# EAGLE design mainboard (EAGLE 9.6.2)
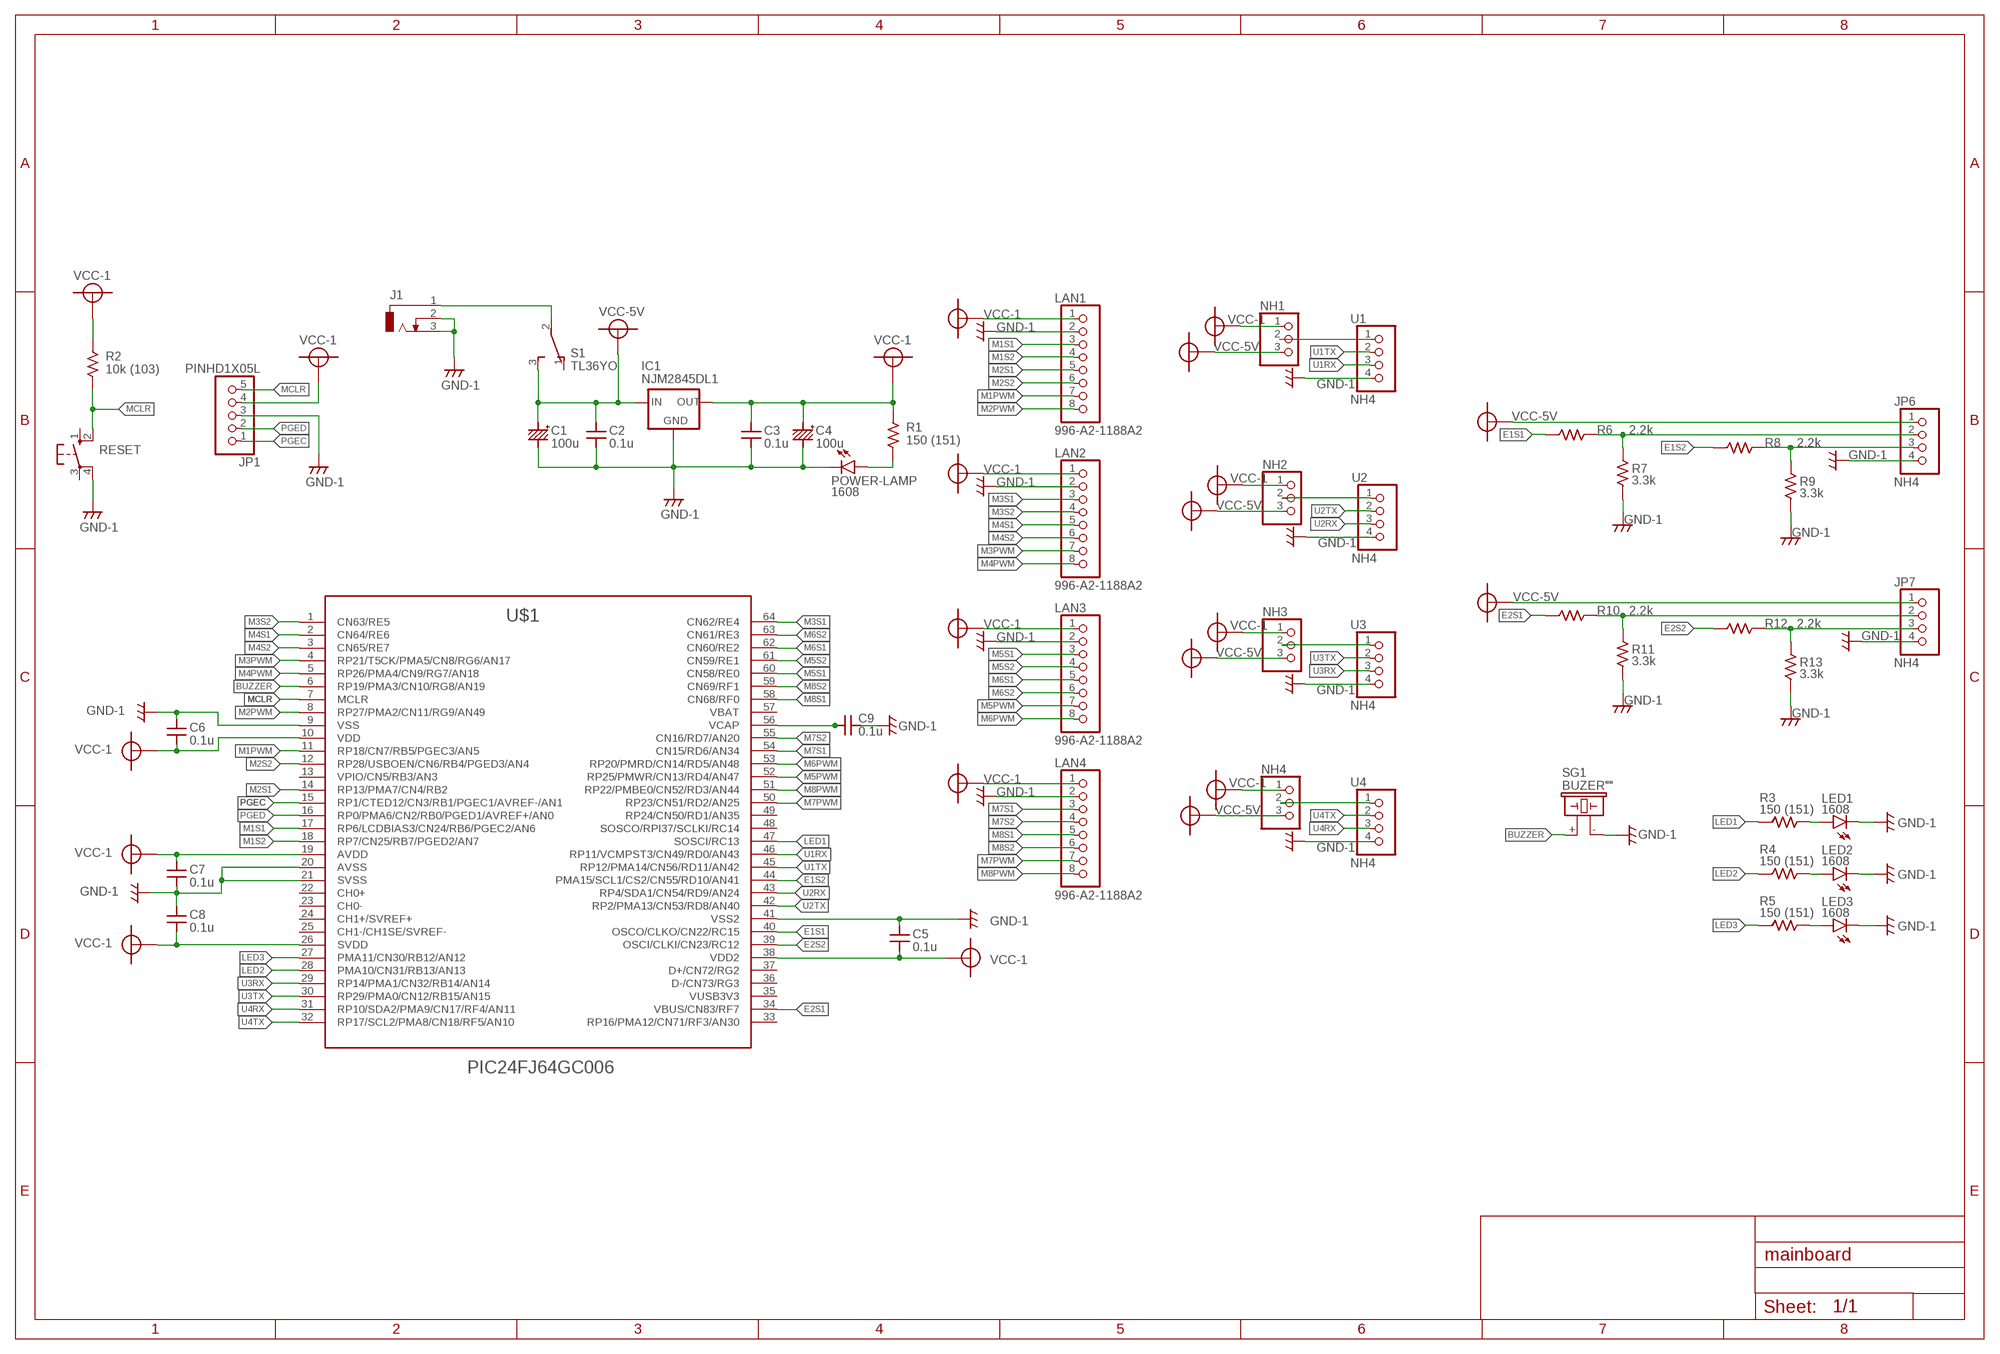
[diagram p0: schematic, sheet 1]

## Parts
C1  100u  C+25V100  [CC:3]
C2  0.1u  CC1068  [C1608]
C3  0.1u  CC1068  [C1608]
C4  100u  C+25V100  [CC:3]
C5  0.1u  CC1068  [C1608]
C6  0.1u  CC1068  [C1608]
C7  0.1u  CC1068  [C1608]
C8  0.1u  CC1068  [C1608]
C9  0.1u  CC1068  [C1608]
IC1  NJM2845DL1  [TO252]
J1  DCJ0303  [DCJ0303]
JP1  PINHD1X05L  [1X05L]
JP6  NH4  [NH4]
JP7  NH4  [NH4]
LAN1  996-A2-1188A2  [996-A2-1188A2]
LAN2  996-A2-1188A2  [996-A2-1188A2]
LAN3  996-A2-1188A2  [996-A2-1188A2]
LAN4  996-A2-1188A2  [996-A2-1188A2]
LED1  1608  LEDCHIP-LED0603  [CHIP-LED0603]
LED2  1608  LEDCHIP-LED0603  [CHIP-LED0603]
LED3  1608  LEDCHIP-LED0603  [CHIP-LED0603]
NH1  PINHD-1X3  [1X03]
NH2  PINHD-1X3  [1X03]
NH3  PINHD-1X3  [1X03]
NH4  PINHD-1X3  [1X03]
POWER-LAMP  1608  LEDCHIP-LED0603  [CHIP-LED0603]
R1  150 (151)  R1/10W  [C1608]
R2  10k (103)  R1/10W  [C1608]
R3  150 (151)  R1/10W  [C1608]
R4  150 (151)  R1/10W  [C1608]
R5  150 (151)  R1/10W  [C1608]
R6  2.2k  R1/10W  [C1608]
R7  3.3k  R1/10W  [C1608]
R8  2.2k  R1/10W  [C1608]
R9  3.3k  R1/10W  [C1608]
R10  2.2k  R1/10W  [C1608]
R11  3.3k  R1/10W  [C1608]
R12  2.2k  R1/10W  [C1608]
R13  3.3k  R1/10W  [C1608]
RESET  10-XX  [B3F-10XX]
S1  TL36YO  [TL3XYO]
SG1  BUZER""  [F/CM12P]
U1  NH4  [NH4]
U2  NH4  [NH4]
U3  NH4  [NH4]
U4  NH4  [NH4]
U$1  PIC24FJ64GC006  [TQFP64-10X10]

## Nets
+5V: C1.+(P$1+) C2.1 IC1.1(IN) JP6.1 JP7.1 NH1.3 NH2.3 NH3.3 NH4.3 S1.3(S) ; supply symbol labelled VCC-5V
BUZZER: SG1.+ U$1.6(RP19/PMA3/CN10/RG8/AN19)
E1S1: R6.2 U$1.40(OSCO/CLKO/CN22/RC15)
E1S2: R8.2 U$1.44(PMA15/SCL1/CS2/CN55/RD10/AN41)
E2S1: R10.2 U$1.34(VBUS/CN83/RF7)
E2S2: R12.2 U$1.39(OSCI/CLKI/CN23/RC12)
GND: C1.-(P$2-) C2.2 C3.2 C4.-(P$2-) C5.1 C6.1 C7.2 C8.1 C9.2 IC1.2(GND) J1.2 J1.3 JP1.3 JP6.4 JP7.4 LAN1.2 LAN2.2 LAN3.2 LAN4.2 LED1.C LED2.C LED3.C POWER-LAMP.C R7.2 R9.2 R11.2 R13.2 RESET.4(P1) SG1.- U1.4 U2.4 U3.4 U4.4 U$1.9(VSS) U$1.20(AVSS) U$1.21(SVSS) U$1.41(VSS2) ; supply symbol labelled GND-1
LED1: R3.2 U$1.47(SOSCI/RC13)
LED2: R4.2 U$1.28(PMA10/CN31/RB13/AN13)
LED3: R5.2 U$1.27(PMA11/CN30/RB12/AN12)
M1PWM: LAN1.7 U$1.11(RP18/CN7/RB5/PGEC3/AN5)
M1S1: LAN1.3 U$1.17(RP6/LCDBIAS3/CN24/RB6/PGEC2/AN6)
M1S2: LAN1.4 U$1.18(RP7/CN25/RB7/PGED2/AN7)
M2PWM: LAN1.8 U$1.8(RP27/PMA2/CN11/RG9/AN49)
M2S1: LAN1.5 U$1.14(RP13/PMA7/CN4/RB2)
M2S2: LAN1.6 U$1.12(RP28/USBOEN/CN6/RB4/PGED3/AN4)
M3PWM: LAN2.7 U$1.4(RP21/T5CK/PMA5/CN8/RG6/AN17)
M3S1: LAN2.3 U$1.64(CN62/RE4)
M3S2: LAN2.4 U$1.1(CN63/RE5)
M4PWM: LAN2.8 U$1.5(RP26/PMA4/CN9/RG7/AN18)
M4S1: LAN2.5 U$1.2(CN64/RE6)
M4S2: LAN2.6 U$1.3(CN65/RE7)
M5PWM: LAN3.7 U$1.52(RP25/PMWR/CN13/RD4/AN47)
M5S1: LAN3.3 U$1.60(CN58/RE0)
M5S2: LAN3.4 U$1.61(CN59/RE1)
M6PWM: LAN3.8 U$1.53(RP20/PMRD/CN14/RD5/AN48)
M6S1: LAN3.5 U$1.62(CN60/RE2)
M6S2: LAN3.6 U$1.63(CN61/RE3)
M7PWM: LAN4.7 U$1.50(RP23/CN51/RD2/AN25)
M7S1: LAN4.3 U$1.54(CN15/RD6/AN34)
M7S2: LAN4.4 U$1.55(CN16/RD7/AN20)
M8PWM: LAN4.8 U$1.51(RP22/PMBE0/CN52/RD3/AN44)
M8S1: LAN4.5 U$1.58(CN68/RF0)
M8S2: LAN4.6 U$1.59(CN69/RF1)
MCLR: JP1.5 R2.1 RESET.2(S1) U$1.7(MCLR)
N$1: JP6.2 R6.1 R7.1
N$2: J1.1 S1.2(P)
N$3: POWER-LAMP.A R1.1
N$4: LED1.A R3.1
N$5: LED2.A R4.1
N$6: LED3.A R5.1
N$7: JP6.3 R8.1 R9.1
N$8: C9.1 U$1.56(VCAP)
N$9: JP7.2 R10.1 R11.1
N$10: JP7.3 R12.1 R13.1
N$11: NH1.2 U1.1
N$12: NH2.2 U2.1
N$13: NH3.2 U3.1
N$14: NH4.2 U4.1
PGEC: JP1.1 U$1.15(RP1/CTED12/CN3/RB1/PGEC1/AVREF-/AN1)
PGED: JP1.2 U$1.16(RP0/PMA6/CN2/RB0/PGED1/AVREF+/AN0)
U1RX: U1.3 U$1.46(RP11/VCMPST3/CN49/RD0/AN43)
U1TX: U1.2 U$1.45(RP12/PMA14/CN56/RD11/AN42)
U2RX: U2.3 U$1.43(RP4/SDA1/CN54/RD9/AN24)
U2TX: U2.2 U$1.42(RP2/PMA13/CN53/RD8/AN40)
U3RX: U3.3 U$1.29(RP14/PMA1/CN32/RB14/AN14)
U3TX: U3.2 U$1.30(RP29/PMA0/CN12/RB15/AN15)
U4RX: U4.3 U$1.31(RP10/SDA2/PMA9/CN17/RF4/AN11)
U4TX: U4.2 U$1.32(RP17/SCL2/PMA8/CN18/RF5/AN10)
VCC-1: C3.1 C4.+(P$1+) C5.2 C6.2 C7.1 C8.2 IC1.3(OUT) JP1.4 LAN1.1 LAN2.1 LAN3.1 LAN4.1 NH1.1 NH2.1 NH3.1 NH4.1 R1.2 R2.2 U$1.10(VDD) U$1.19(AVDD) U$1.26(SVDD) U$1.38(VDD2)
Unconnected: RESET.1(S) RESET.3(P) S1.1(O) U$1.13(VPIO/CN5/RB3/AN3) U$1.22(CH0+) U$1.23(CH0-) U$1.24(CH1+/SVREF+) U$1.25(CH1-/CH1SE/SVREF-) U$1.33(RP16/PMA12/CN71/RF3/AN30) U$1.35(VUSB3V3) U$1.36(D-/CN73/RG3) U$1.37(D+/CN72/RG2) U$1.48(SOSCO/RPI37/SCLKI/RC14) U$1.49(RP24/CN50/RD1/AN35) U$1.57(VBAT)

## Library data of the parts
C1 C4 = Robocon-RLC:C+: Condensare
C2 C3 C5-C9 = Robocon-RLC:CC: Ceramic Condensare
IC1 = Robocon-Regulator:NJM2845DL1
J1 = con-jack:DCJ0303: DC POWER JACK Source: DCJ0303.pdf; OC_FARNELL: unknown; OC_NEWARK: unknown
JP1 = Robocon-Connector:PINHD1X05L
JP6 JP7 U1-U4 = Robocon-Connector:NH4
LAN1-LAN4 = Robocon-Connector:996-A2-1188A2: LAN_Connectoｒ 996-A2-1188A2 Made by PINREX
LED1-LED3 POWER-LAMP = led:LED: LED OSRAM: - CHIPLED LG R971, LG N971, LY N971, LG Q971, LY Q971, LO R971, LY R971 LH N974, LH R974 LS Q976, LO Q976, LY Q976 LO Q996 - Hyper CHIPLED LW Q18S LB Q993, LB Q99A, LB R99A - SideLED LS A670, LO A670, LY A670, LG A670, LP A670 LB A673, LV A673, LT A673, LW A673 LH A674 LY A675 LS A676, LA A676, LO A676, LY A676, LW A676 LS A679, LY A679, LG A679 - Hyper Micro SIDELED® LS Y876, LA Y876, LO Y876, LY Y876 LT Y87S - SmartLED LW L88C, LW L88S LB L89C, LB L89S, LG L890 LS L89K, LO L89K, LY L89K LS L896, LA L896, LO L896, LY L896 - TOPLED LS T670, LO T670, LY T670, LG T670, LP T670 LSG T670, LSP T670, LSY T670, LOP T670, LYG T670 LG T671, LOG T671, LSG T671 LB T673, LV T673, LT T673, LW T673 LH T674 LS T676, LA T676, LO T676, LY T676, LB T676, LH T676, LSB T676, LW T676 LB T67C, LV T67C, LT T67C, LS T67K, LO T67K, LY T67K, LW E67C LS E67B, LA E67B, LO E67B, LY E67B, LB E67C, LV E67C, LT E67C LW T67C LS T679, LY T679, LG T679 LS T770, LO T770, LY T770, LG T770, LP T770 LB T773, LV T773, LT T773, LW T773 LH T774 LS E675, LA E675, LY E675, LS T675 LS T776, LA T776, LO T776, LY T776, LB T776 LHGB T686 LT T68C, LB T68C - Hyper Mini TOPLED® LB M676 - Mini TOPLED Santana® LG M470 LS M47K, LO M47K, LY M47K Source: http://www.osram.convergy.de LUXEON: - LUMILED® LXK2-PW12-R00, LXK2-PW12-S00, LXK2-PW14-U00, LXK2-PW14-V00 LXK2-PM12-R00, LXK2-PM12-S00, LXK2-PM14-U00 LXK2-PE12-Q00, LXK2-PE12-R00, LXK2-PE12-S00, LXK2-PE14-T00, LXK2-PE14-U00 LXK2-PB12-K00, LXK2-PB12-L00, LXK2-PB12-M00, LXK2-PB14-N00, LXK2-PB14-P00, LXK2-PB14-Q00 LXK2-PR12-L00, LXK2-PR12-M00, LXK2-PR14-Q00, LXK2-PR14-R00 LXK2-PD12-Q00, LXK2-PD12-R00, LXK2-PD12-S00 LXK2-PH12-R00, LXK2-PH12-S00 LXK2-PL12-P00, LXK2-PL12-Q00, LXK2-PL12-R00 Source: www.luxeon.com KINGBRIGHT: KA-3528ASYC Source: www.kingbright.com
NH1-NH4 = Robocon-Pin_Header:PINHD-1X3: PIN HEADER
R1-R13 = Robocon-RLC:R: Resistor
RESET = Robocon-Switches:10-XX: OMRON SWITCH; MPN: B3F-1000; OC_FARNELL: 176432; OC_NEWARK: 36M3542
S1 = Robocon-Switches:TL36YO: TINY SWITCH ON - ON Source: http://www2.produktinfo.conrad.com/datenblaetter/700000-724999/705152-da-01-de-Subminiaturschalter_TL_36YO.pdf
SG1 = Robocon-Other:BUZER: BUZZER Source: Buerklin; OC_FARNELL: unknown; OC_NEWARK: unknown
U$1 = Robocon-PICMicroController:PIC24FJ64GC006

## Board
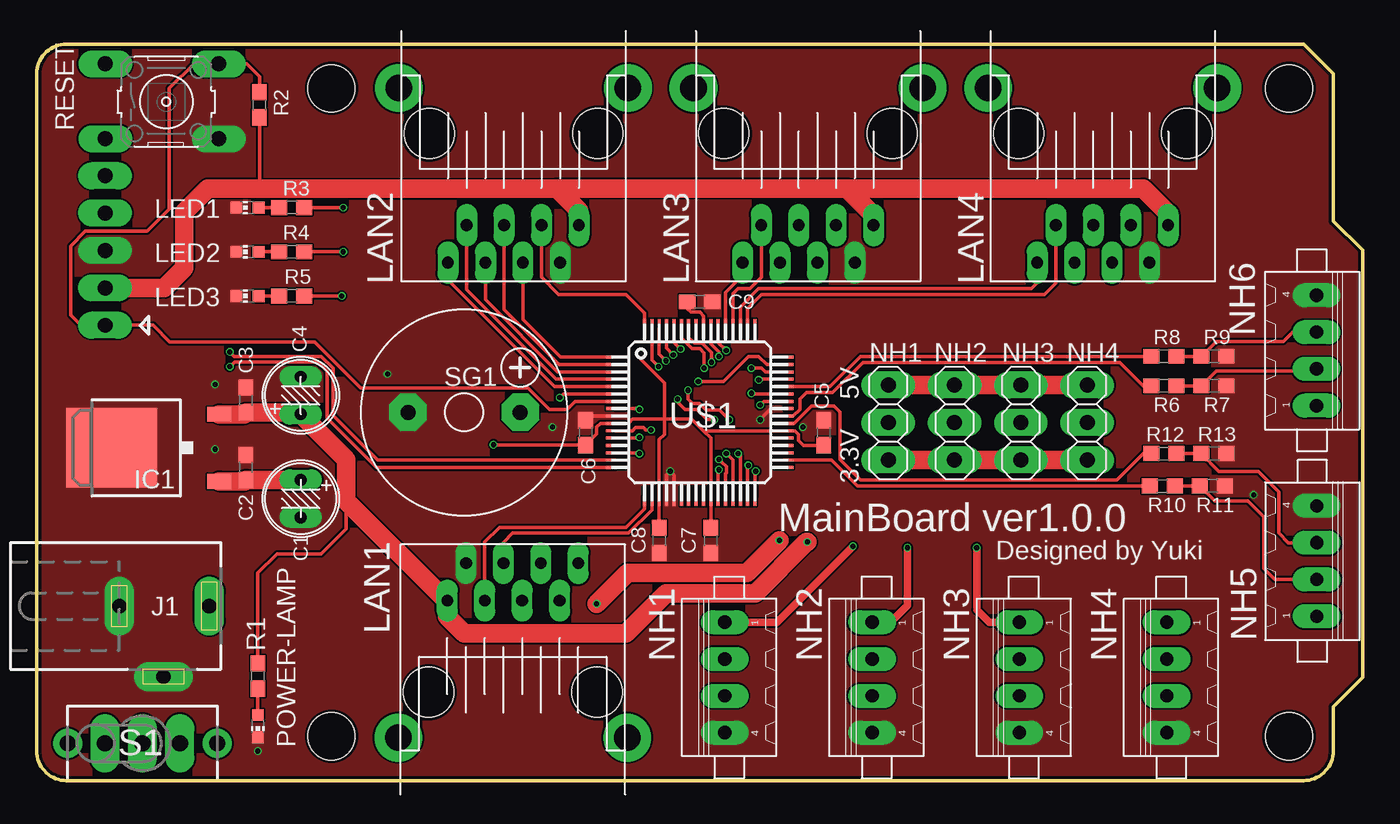
[diagram p1: board, top side]
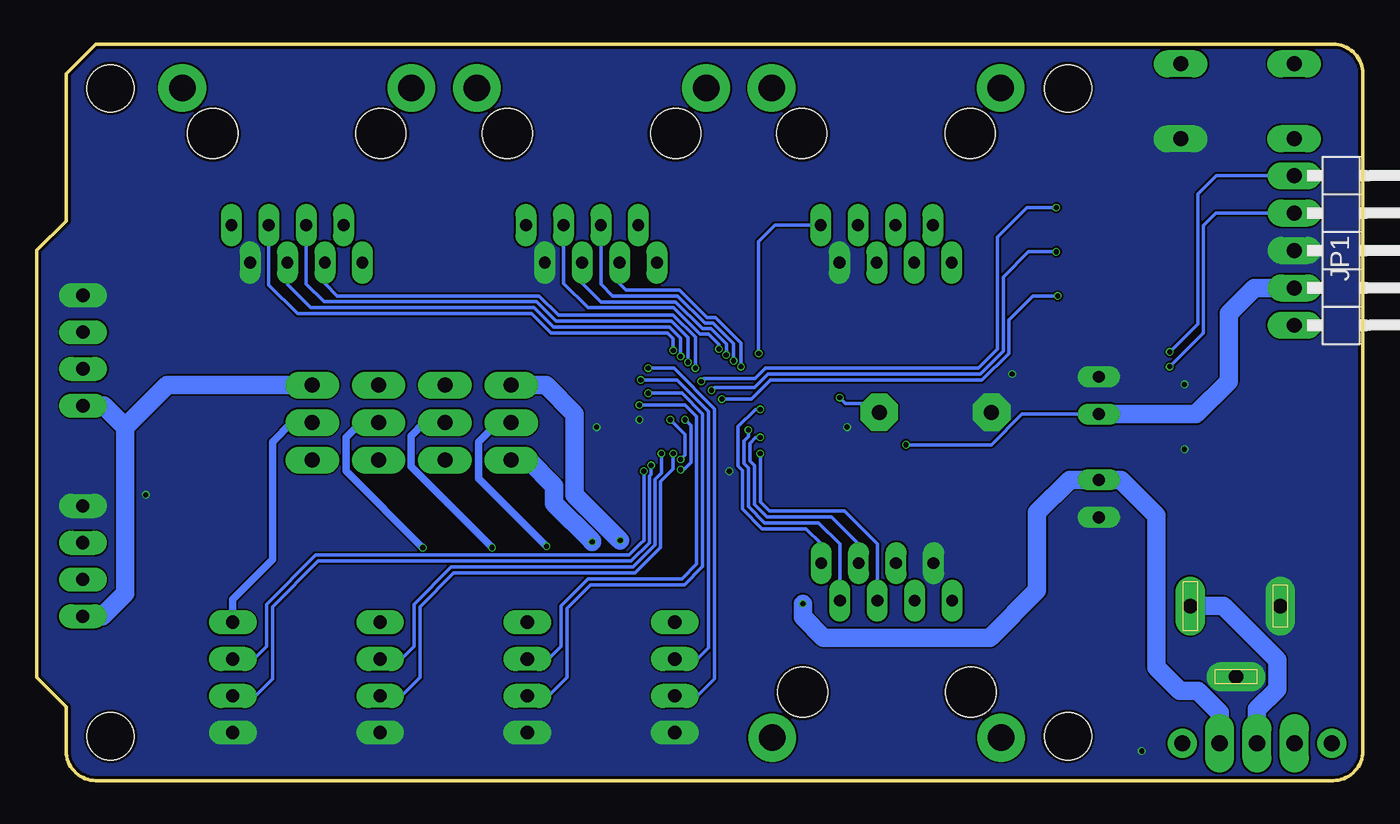
[diagram p2: board, bottom side, seen from below]

Size 90 x 50 mm. Coordinates in mm from the lower left corner, seen from the top.
Outline: 2,0 arc-90 0,2 0,48 arc-90 2,50 86,50 88,48 88,38 90,36 90,7 88,5 88,2 arc-90 86,0 2,0
Copper layers (1*16): Top 0.035mm / dielectric 1.6mm / Bottom 0.035mm
Design rules "jlcpcb-2layers": minimum track width 5mil, minimum drill 0.3mm, track to track 5mil, track to pad 5mil, pad to pad 5mil, via to via 5mil, smd to smd 5mil, copper to edge 0.2mm, drill to drill 6mil, minimum pad ring 10mil, minimum via ring 3mil, stop-mask expansion 4mil, vias tented up to drill 0mil, thermal gap 10mil
Holes 3.2 mm at 20,3 85,47 20,47 85,3

### Footprints (pad centres in the part's own frame; a part is rotated, then mirrored left to right if it is on the bottom)
CC:3 = drill 0.8 long: + -1.27,0; - 1.27,0
C1608 = smd 1.1 x 1: 1 -0.85,0; 2 0.85,0
TO252 = smd 1 x 1.6: 1 -2.28,-4.8; 3 2.28,-4.8 | smd 5.4 x 6.2: 2 0,2.5
DCJ0303 = drill 1 pad 2 long: 1 0,3.1; 2 4.8,0; 3 0,-3
1X05L = drill 1.016 long: 1 -5.08,-3.81; 2 -2.54,-3.81; 3 0,-3.81; 4 2.54,-3.81; 5 5.08,-3.81
NH4 = drill 0.9 long: 1 3.75,0.3; 2 1.25,0.3; 3 -1.25,0.3; 4 -3.75,0.3
996-A2-1188A2 = drill 0.8 long: 1 -4.465,4.69; 2 -3.195,7.23; 3 -1.925,4.69; 4 -0.655,7.23; 5 0.615,4.69; 6 1.885,7.23; 7 3.155,4.69; 8 4.425,7.23 | drill 1.8: P$1 -7.795,-4.623; P$2 7.755,-4.623 | hole 3.4: -5.735,-1.533; 5.695,-1.533
CHIP-LED0603 = smd 0.8 x 0.8: A 0,-0.75; C 0,0.75
1X03 = drill 1.016 long: 1 -2.54,0; 2 0,0; 3 2.54,0
B3F-10XX = drill 1.016 long: 1 -2.553,2.578; 2 5.156,2.578; 3 -2.553,-2.515; 4 5.156,-2.515
TL3XYO = drill 1.1 pad 1.422 long: 1 -2.54,0; 2 0,0; 3 2.54,0 | drill 1.1 pad 1.676: M1 -5.08,0; M2 5.08,0
F/CM12P = drill 1.016 pad 2.54 octagon: + 3.81,0; - -3.81,0
TQFP64-10X10 = smd 1.3 x 0.2: 1 -5.7,3.75; 2 -5.7,3.25; 3 -5.7,2.75; 4 -5.7,2.25; 5 -5.7,1.75; 6 -5.7,1.25; 7 -5.7,0.75; 8 -5.7,0.25; 9 -5.7,-0.25; 10 -5.7,-0.75; 11 -5.7,-1.25; 12 -5.7,-1.75; 13 -5.7,-2.25; 14 -5.7,-2.75; 15 -5.7,-3.25; 16 -5.7,-3.75; 33 5.7,-3.75; 34 5.7,-3.25; 35 5.7,-2.75; 36 5.7,-2.25; 37 5.7,-1.75; 38 5.7,-1.25; 39 5.7,-0.75; 40 5.7,-0.25; 41 5.7,0.25; 42 5.7,0.75; 43 5.7,1.25; 44 5.7,1.75; 45 5.7,2.25; 46 5.7,2.75; 47 5.7,3.25; 48 5.7,3.75 | smd 0.2 x 1.3: 17 -3.75,-5.7; 18 -3.25,-5.7; 19 -2.75,-5.7; 20 -2.25,-5.7; 21 -1.75,-5.7; 22 -1.25,-5.7; 23 -0.75,-5.7; 24 -0.25,-5.7; 25 0.25,-5.7; 26 0.75,-5.7; 27 1.25,-5.7; 28 1.75,-5.7; 29 2.25,-5.7; 30 2.75,-5.7; 31 3.25,-5.7; 32 3.75,-5.7; 49 3.75,5.7; 50 3.25,5.7; 51 2.75,5.7; 52 2.25,5.7; 53 1.75,5.7; 54 1.25,5.7; 55 0.75,5.7; 56 0.25,5.7; 57 -0.25,5.7; 58 -0.75,5.7; 59 -1.25,5.7; 60 -1.75,5.7; 61 -2.25,5.7; 62 -2.75,5.7; 63 -3.25,5.7; 64 -3.75,5.7

### Placement (x,y rotation side)
C1  17.91,19.14 270 top
C2  14.2,21.26 90 top
C3  14.2,25.83 90 top
C4  17.91,26.15 90 top
C5  53.41,23.61 270 top
C6  37.25,23.62 270 top
C7  45.75,16.3 270 top
C8  42.25,16.3 90 top
C9  45,32.5 0 top
IC1  7.58,22.59 90 top
J1  8.6,11.85 270 top
JP1  0.83,35.99 270 bottom
JP6  86.56,29.2 270 top
JP7  86.58,14.9 270 top
LAN1  32.33,7.53 0 top
LAN2  32.33,42.4 180 top
LAN3  52.33,42.4 180 top
LAN4  72.33,42.4 180 top
LED1  14.3,38.9 90 top
LED2  14.3,35.9 90 top
LED3  14.3,32.9 90 top
NH1  57.8,24.3 90 top
NH2  62.3,24.3 90 top
NH3  66.8,24.3 90 top
NH4  71.3,24.3 90 top
POWER-LAMP  15,3.69 180 top
R1  15,7.1 90 top
R2  15.11,45.88 270 top
R3  17.3,38.9 0 top
R4  17.3,35.9 0 top
R5  17.3,32.9 0 top
R6  76.5,26.8 180 top
R7  79.9,26.8 0 top
R8  76.5,28.8 180 top
R9  79.9,28.8 0 top
R10  76.4,20 180 top
R11  79.8,20 0 top
R12  76.5,22.2 180 top
R13  79.9,22.2 0 top
RESET  7.2,46.09 0 top
S1  7.17,2.53 0 top
SG1  29,25 0 top
U1  47,7 90 top
U2  57,7 90 top
U3  67,7 90 top
U4  77,7 90 top
U$1  45,25 0 top

### Tracks (layer width: path | path; a pad name or v marks a point on that pad's centre or on a via)
+5V  (via drill 0.35)
  Top 1.25: IC1.1 14.1,20.31 C2.1 C1.+ | v38,12 40.1,14.1 48.2,14.1 v50.4,16.3 | NH1.3 NH2.3 NH3.3 NH4.3
  Bottom 1.25: S1.3 9.71,4.61 11.2,6.1 12.4,6.1 14,7.7 14,18 16.41,20.41 C1.+ 19.89,20.41 22.1,18.2 22.1,12.9 25.3,9.7 36.6,9.7 38,11.1 v38,12 | JP6.1 85.45,25.45 84,24 | JP7.1 85.55,11.15 84,12.7 84,24 | NH1.3 55.44,26.84 53.5,24.9 53.5,19.4 v50.4,16.3 | NH4.3 81.16,26.84 84,24
BUZZER  (via drill 0.35)
  Top 0.25: U$1.6 35.75,26.25 v35.5,26
  Bottom 0.25: v35.5,26 35.1,25.6 33.3,25.6 32.81,25.11 SG1.+
E1S1
  Top 0.25: R6.2 75.1,26.8 73.5,28.4 56.07,28.4 54.02,26.35 52.25,26.35 51.8,25.9 51.8,25.21 51.34,24.75 U$1.40
E1S2
  Top 0.25: U$1.44 53.85,26.75 55.9,28.8 R8.2
E2S1
  Top 0.25: U$1.34 53.95,21.75 55.7,20 R10.2
E2S2
  Top 0.25: U$1.39 51.41,24.25 52.58,25.42 54.1,25.42 54.5,25.02 54.5,21.8 55.9,20.4 73.3,20.4 75.1,22.2 R12.2
GND  (via drill 0.35)
  Top 0.25: U$1.41 49.85,25.25 v49.1,24.5 | U$1.9 37.53,24.75 C6.1 | U$1.20 42.75,20.75 v43,21 43.25,20.75 U$1.21
  other vias: 12.1,22.5 12.1,26.9 23.8,27.6 15,2 82.6,19.4 52,24 35,24
  pour Bottom (no thermals): 90,50 2,50 arc90 0,48 0,2 arc90 2,0 90,0
  pour Top (no thermals): 90,50 2,50 arc90 0,48 0,2 arc90 2,0 90,0
LED1  (via drill 0.35)
  Top 0.25: U$1.47 49.55,28.25 49,28.8 48.3,28.8 46.6,27.1 v44.9,27.1 | R3.2 v20.8,38.9
  Bottom 0.25: v44.9,27.1 44.7,27.3 41.24,27.3 40.53,28 26.09,28 24.8,29.3 24.8,36.9 22.8,38.9 v20.8,38.9
LED2  (via drill 0.35)
  Top 0.25: v47,24.5 46.34,25.16 45.41,25.16 44.97,25.6 44.5,25.6 44.2,25.9 v44.2,26.5 | R4.2 v20.8,35.9 | U$1.28 46.75,20.84 46.8,20.89 46.8,21.31 46.51,21.6 46.5,21.6 v46.3,21.8
  Bottom 0.25: v47,24.5 v47,24.49 46.01,23.5 46.01,22.09 v46.3,21.8 | v44.2,26.5 44,26.7 41.27,26.7 40.37,27.6 25.96,27.6 24.4,29.16 24.4,34.2 22.7,35.9 v20.8,35.9
LED3  (via drill 0.35)
  Top 0.25: v46,24.5 45.5,24.5 44.8,25.2 44,25.2 43.5,25.7 v43.5,25.9 | R5.2 v20.7,32.9 | U$1.27 46.25,21.05 v46.3,21.1
  Bottom 0.25: v46,24.5 45.61,24.11 45.61,21.59 46.1,21.1 v46.3,21.1 | v43.5,25.9 41.5,25.9 40.2,27.2 25.83,27.2 24.02,29.01 24.02,31.27 22.4,32.9 v20.7,32.9
M1PWM  (via drill 0.35)
  Top 0.25: U$1.11 40.42,23.75 40.63,23.96 41.17,23.96 41.33,23.8 v41.7,23.8
  Bottom 0.25: LAN1.7 35.48,16.05 36.93,17.5 40.61,17.5 41.7,18.59 41.7,21.23 42,21.53 42,23.07 41.7,23.37 v41.7,23.8
M1S1
  Top 0.25: U$1.17 41.25,18.45 40,17.2 31.4,17.2 30.41,16.2 LAN1.3
M1S2
  Top 0.25: U$1.18 41.75,18.38 40.17,16.8 32.3,16.8 31.68,16.18 LAN1.4
M2PWM  (via drill 0.35)
  Top 0.25: U$1.8 40.85,25.25 v40.9,25.2
  Bottom 0.25: LAN1.8 36.76,16.05 37.8,17.1 40.77,17.1 42.1,18.43 42.1,21.06 42.41,21.37 42.41,24.02 41.23,25.2 v40.9,25.2
M2S1  (via drill 0.35)
  Top 0.25: U$1.14 40.85,22.25 v40.9,22.2
  Bottom 0.25: v40.9,22.2 v40.89,22.19 40.89,18.93 40.27,18.31 35.19,18.31 32.95,16.06 LAN1.5
M2S2  (via drill 0.35)
  Top 0.25: U$1.12 40.85,23.25 v40.9,23.3
  Bottom 0.25: LAN1.6 34.22,16.05 36.07,17.91 40.44,17.91 41.3,18.76 41.3,21.39 41.6,21.7 41.6,22.9 41.2,23.3 v40.9,23.3
M3PWM
  Top 0.25: LAN2.7 29.18,33.33 35.25,27.25 U$1.4
M3S1
  Top 0.25: LAN2.3 34.26,34.17 35.42,33 40,33 41.25,31.75 U$1.64
M3S2
  Top 0.25: LAN2.4 33,35.16 33,31.3 35.55,28.75 U$1.1
M4PWM
  Top 0.25: LAN2.8 27.91,33.99 35.15,26.75 U$1.5
M4S1
  Top 0.25: LAN2.5 31.71,31.98 35.45,28.25 U$1.2
M4S2
  Top 0.25: LAN2.6 30.45,32.66 35.35,27.75 U$1.3
M5PWM
  Top 0.25: U$1.52 47.25,33.05 47.6,33.4 48.4,33.4 49.17,34.17 LAN3.7
M5S1  (via drill 0.35)
  Top 0.25: v43.7,29.3 43.25,29.75 U$1.60
  Bottom 0.25: LAN3.3 54.26,33.76 52.6,32.1 46.77,32.1 44.97,30.3 44.4,30.3 43.7,29.6 v43.7,29.3
M5S2  (via drill 0.35)
  Top 0.25: v43.2,28.9 42.75,29.35 U$1.61
  Bottom 0.25: LAN3.4 52.98,33.79 51.7,32.5 46.64,32.5 44.81,30.68 44.24,30.68 43.2,29.63 43.2,29.09 v43.2,28.9
M6PWM
  Top 0.25: U$1.53 46.75,33.12 47.91,34.27 LAN3.8
M6S1  (via drill 0.35)
  Top 0.25: v42.7,28.5 42.25,28.95 U$1.62
  Bottom 0.25: LAN3.5 51.72,33.72 50.91,32.91 46.51,32.91 44.66,31.05 44.09,31.05 42.7,29.66 42.7,28.69 v42.7,28.5
M6S2  (via drill 0.35)
  Top 0.25: v42.2,28.1 41.75,28.55 U$1.63
  Bottom 0.25: LAN3.6 50.45,33.75 50,33.31 46.38,33.31 44.5,31.43 43.93,31.43 42.2,29.7 42.2,28.29 v42.2,28.1
M7PWM
  Top 0.25: LAN4.7 69.17,33.77 68.4,33 49.2,33 48.25,32.05 U$1.50
M7S1  (via drill 0.35)
  Top 0.25: v46.8,29.2 46.25,29.75 U$1.54
  Bottom 0.25: LAN4.3 74.25,33.66 72.3,31.7 56.41,31.7 55.1,30.39 47.19,30.39 46.8,30 v46.8,29.2
M7S2  (via drill 0.35)
  Top 0.25: v46.3,28.8 46.3,29.1 45.75,29.65 U$1.55
  Bottom 0.25: LAN4.4 72.98,33.69 71.4,32.1 56.24,32.1 54.93,30.8 47.06,30.8 46.3,30.03 46.3,28.99 v46.3,28.8
M8PWM
  Top 0.25: LAN4.8 67.91,33.81 67.5,33.4 49,33.4 47.75,32.15 U$1.51
M8S1  (via drill 0.35)
  Top 0.25: v45.8,28.4 45.8,28.59 45.8,29.07 45.17,29.7 44.64,29.7 44.25,30.09 U$1.58
  Bottom 0.25: LAN4.5 71.72,33.72 70.5,32.51 56.07,32.51 54.77,31.2 46.93,31.2 45.8,30.06 45.8,28.59 v45.8,28.4
M8S2  (via drill 0.35)
  Top 0.25: v45.3,28 45.3,28.19 45.3,29.04 45.01,29.32 44.49,29.32 43.75,30.06 U$1.59
  Bottom 0.25: LAN4.6 70.44,33.75 69.6,32.91 55.91,32.91 54.6,31.6 46.8,31.6 45.3,30.1 45.3,28.19 v45.3,28
MCLR
  Top 0.25: U$1.7 36.55,25.75 36,25.2 34.8,25.2 33.35,26.65 21.99,26.65 18.86,29.78 9.02,29.78 7.89,30.91 JP1.5 2.99,30.91 2.3,31.6 2.3,36.3 3.3,37.3 7.5,37.3 9,38.8 9,47 10.67,48.67 RESET.2 14.23,48.67 15.11,47.79 R2.1
N$1
  Top 0.25: R6.1 R7.1 80.05,27.8 86.71,27.8 JP6.2
N$2
  Bottom 1.25: S1.2 7.17,4.83 5.8,6.2 5.8,8.2 9.45,11.85 J1.1
N$3
  Top 0.25: R1.1 POWER-LAMP.A
N$4
  Top 0.25: LED1.A R3.1
N$5
  Top 0.25: LED2.A R4.1
N$6
  Top 0.25: LED3.A R5.1
N$7
  Top 0.25: R8.1 R9.1 80.05,29.8 84.6,29.8 85.25,30.45 JP6.3
N$8
  Top 0.25: U$1.56 45.25,31.55 45,31.8 44.4,31.8 44.15,32.05 C9.1
N$9
  Top 0.25: R10.1 R11.1 79.95,19 82.2,19 83.3,17.9 83.3,14.4 84.05,13.65 JP7.2
N$10
  Top 0.25: R12.1 R13.1 80.25,21 82.9,21 84.3,19.6 84.3,16.8 84.95,16.15 JP7.3
N$11  (via drill 0.35)
  Top 0.5: U1.1 50.25,10.75 v55.4,15.9
  Bottom 0.5: v55.4,15.9 60.01,20.51 60.01,22.99 58.7,24.3 NH1.2
N$12  (via drill 0.35)
  Top 0.5: v59.1,15.81 59.1,11.9 57.95,10.75 U2.1
  Bottom 0.5: NH2.2 63.7,24.3 64.59,23.41 64.59,21.31 v59.1,15.82 v59.1,15.81
N$13  (via drill 0.35)
  Top 0.5: v63.8,15.81 63.8,11.6 64.65,10.75 U3.1
  Bottom 0.5: NH3.2 68,24.3 69.01,23.29 69.01,21.01 v63.81,15.81 v63.8,15.81
N$14
  Bottom 0.5: U4.1 76.7,12.3 74,15 74,23 72.7,24.3 NH4.2
PGEC  (via drill 0.35)
  Top 0.25: U$1.15 23.15,21.75 20.1,24.8 20.1,28 19.3,28.8 13.4,28.8 v13.1,29.1
  Bottom 0.25: v13.1,29.1 11.2,31 11.2,39.8 9.93,41.07 JP1.1
PGED  (via drill 0.35)
  Top 0.25: U$1.16 23.05,21.25 19.7,24.6 19.7,27.8 19.08,28.42 13.42,28.42 v13.1,28.1
  Bottom 0.25: v13.1,28.1 10.82,30.38 10.82,37.68 10.25,38.25 10.07,38.43 9.97,38.53 JP1.2
U1RX  (via drill 0.35)
  Top 0.25: U$1.46 49.45,27.75 49.2,28 v48.5,28
  Bottom 0.25: U1.3 45.15,5.75 44,6.9 44,25.24 46.76,28 v48.5,28
U1TX  (via drill 0.35)
  Top 0.25: U$1.45 49.05,27.25 v49,27.2
  Bottom 0.25: U1.2 45.15,8.25 44.4,9 44.4,25.07 46.53,27.2 v49,27.2
U2RX  (via drill 0.35)
  Top 0.25: v48.5,26.3 48.55,26.25 U$1.43
  Bottom 0.25: U2.3 55.25,5.75 54,7 54,11.7 52.41,13.29 46.04,13.29 44.8,14.53 44.8,24.9 46.2,26.3 v48.5,26.3
U2TX  (via drill 0.35)
  Top 0.25: U$1.42 49.35,25.75 v49.1,25.5
  Bottom 0.25: U2.2 55.25,8.25 54.4,9.1 54.4,11.87 52.57,13.7 46.21,13.7 45.2,14.7 45.2,24.7 46,25.5 v49.1,25.5
U3RX  (via drill 0.35)
  Top 0.25: U$1.29 47.25,21.75 v46.8,22.2
  Bottom 0.25: U3.3 65.25,5.75 64,7 64,11.8 61.7,14.1 49.4,14.1 47.67,15.83 47.67,20.3 46.8,21.16 46.8,22.01 v46.8,22.2
U3TX  (via drill 0.35)
  Top 0.25: U$1.30 47.75,22.05 v47.6,22.2
  Bottom 0.25: U3.2 65.25,8.25 64.4,9.1 64.4,11.97 61.87,14.5 49.53,14.5 48.05,15.99 48.05,20.45 47.6,20.9 v47.6,22.2
U4RX  (via drill 0.35)
  Top 0.25: U$1.31 48.25,21.35 v48.3,21.4
  Bottom 0.25: U4.3 75.15,5.75 74,6.9 74,11.8 70.89,14.9 49.66,14.9 48.42,16.14 48.42,20 48.42,20.27 48.42,20.66 48.3,20.79 48.3,21.21 v48.3,21.4
U4TX  (via drill 0.35)
  Top 0.25: U$1.32 48.75,20.95 v48.8,21
  Bottom 0.25: U4.2 75.25,8.25 74.4,9.1 74.4,11.97 71.06,15.31 49.79,15.31 49.05,16.05 48.8,16.3 v48.8,21
VCC-1  (via drill 0.35)
  Top 0.25: R1.2 15,14.1 16.3,15.4 19.3,15.4 21,17.1 21,19 | 45.25,23.75 45.75,23.25 U$1.26 C7.1 | 45.25,23.75 U$1.38 51.45,23.75 51.7,23.5 51.7,23.1 52.04,22.76 C5.2 | C8.2 U$1.19 42.25,23.15 42.6,23.5 42.6,24.54 | 42.6,24.54 40.44,24.54 40.15,24.25 U$1.10 38.25,24.25 38,24 38,23.52 C6.2 31.03,22.77 v31,22.8 | 42.6,24.54 44.46,24.54 45.25,23.75 | v41,29 41,28.59 42.6,26.99 42.6,24.54 | R2.2 15.11,40.2
  Top 1.25: LAN4.1 76.8,38.51 75.1,40.2 55,40.2 | 55,40.2 35.3,40.2 | 35.3,40.2 15.11,40.2 11.6,40.2 10,38.6 10,34.8 8.65,33.45 JP1.4 | IC1.3 14.09,24.87 C3.1 17.81,24.98 C4.+ 21,21.79 21,19 27.78,12.22 LAN1.1 27.86,11.13 29,10 40,10 42.72,12.72 48.77,12.72 52.25,16.2 v52.3,16.2 | LAN3.1 56.8,38.41 55,40.2 | LAN2.1 36.8,38.7 35.3,40.2 | NH4.1 NH3.1 NH2.1 NH1.1
  Bottom 0.25: v41,29 41,36.6 39.89,37.71 LAN2.1 | v31,22.8 25.2,22.8 23.12,24.88 C4.+
  Bottom 1.25: NH1.1 56.64,21.76 54.88,20 54.88,18.83 52.3,16.25 v52.3,16.2 | C4.+ 11.32,24.88 9.1,27.1 9.1,31.7 7.35,33.45 JP1.4

### Text on the board
tNames: NH6 | 5V | 3.3V | MainBoard ver1.0.0 | Designed by Yuki | NH5 | NH1 | NH2 | NH3 | NH4